# EAGLE schematic air (EAGLE 9.0.0)
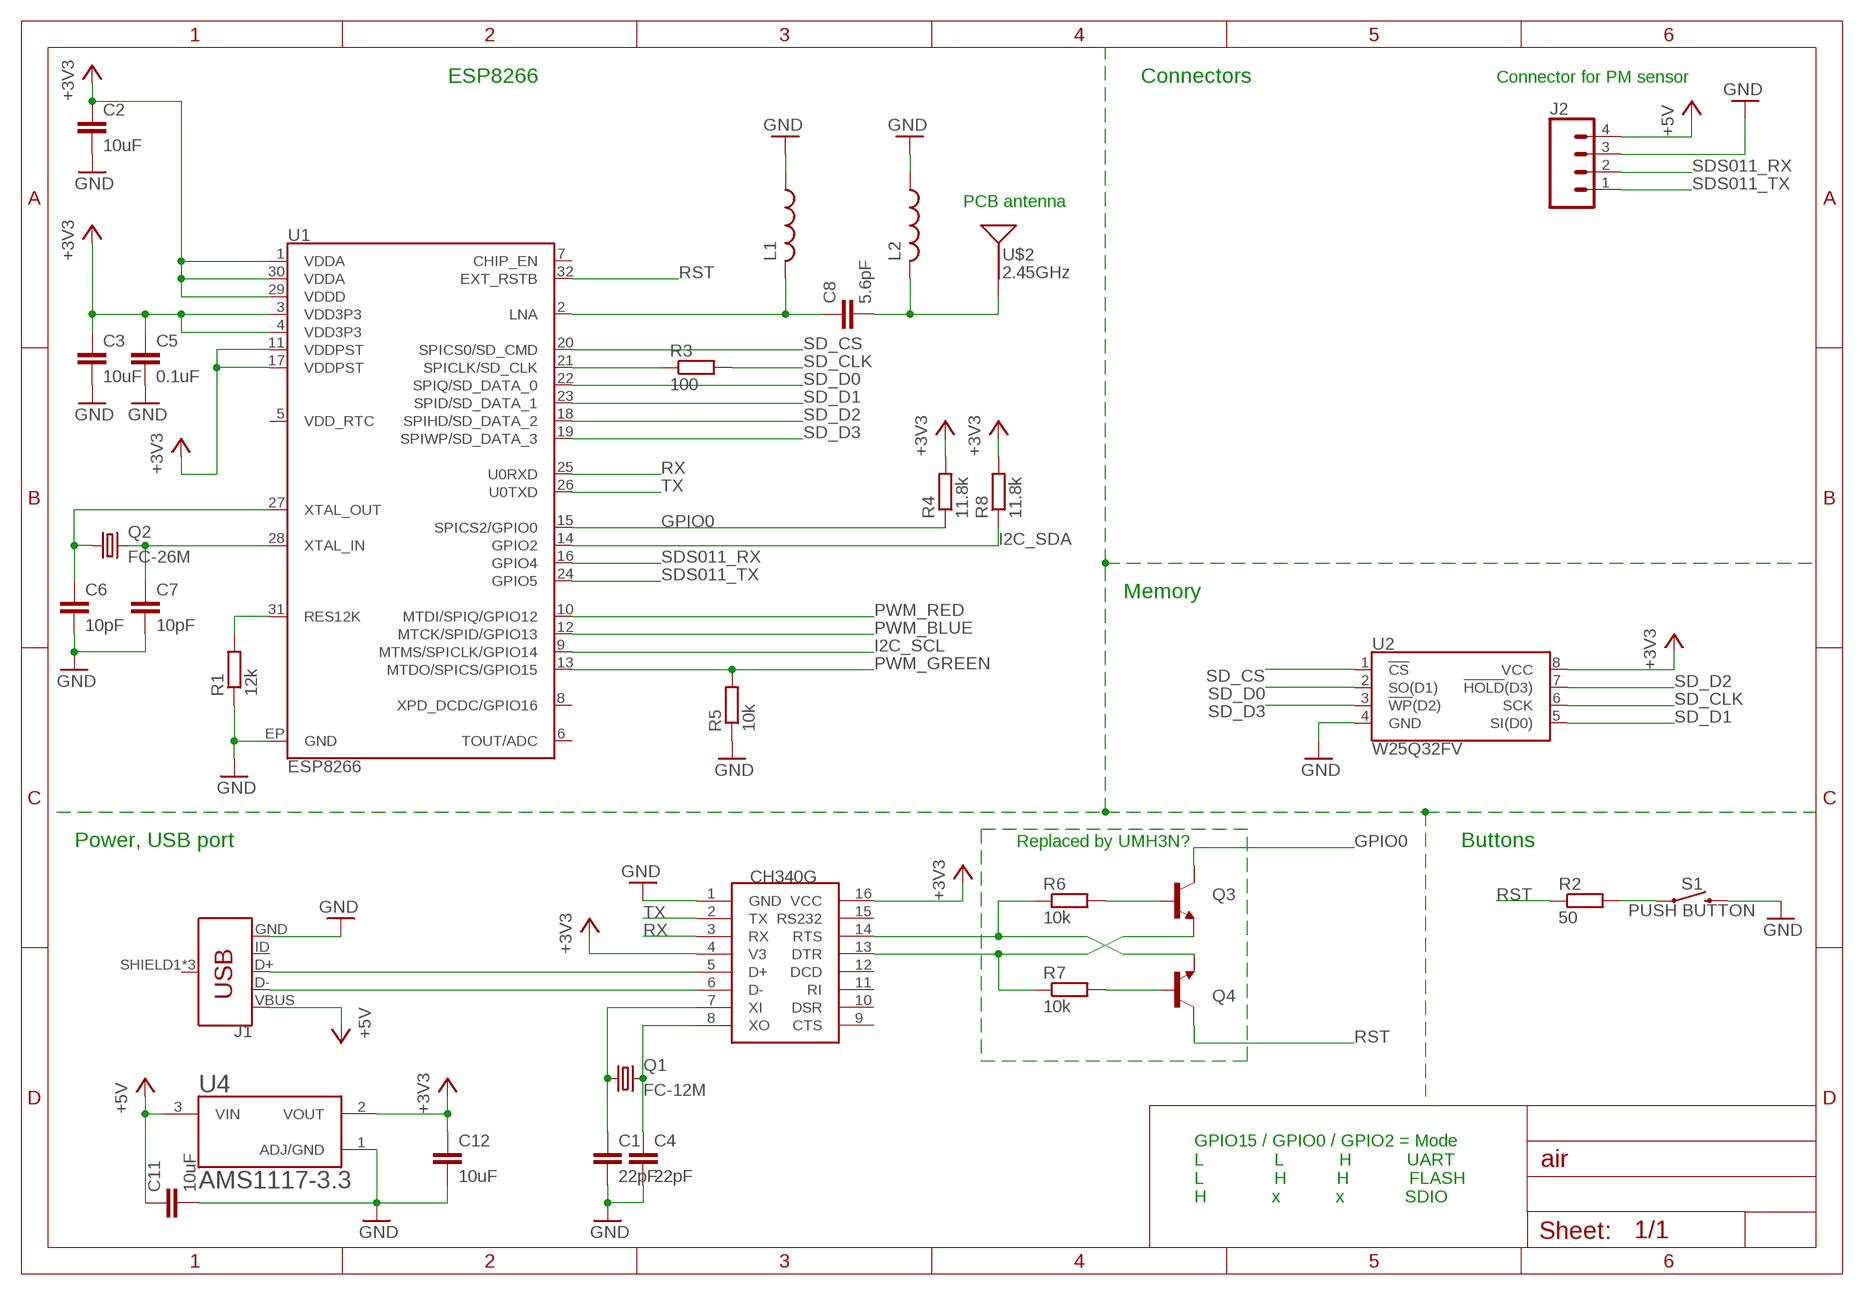
[diagram p0: schematic, sheet 1]

## Parts
C1  22pF  C-EUC1206  [C1206]
C2  10uF  C-EUC1206  [C1206]
C3  10uF  C-EUC1206  [C1206]
C4  22pF  C-EUC1206  [C1206]
C5  0.1uF  C-EUC1206  [C1206]
C6  10pF  C-EUC1206  [C1206]
C7  10pF  C-EUC1206  [C1206]
C8  5.6pF  C-EUC1206  [C1206]
C11  10uF  C-EUC1206  [C1206]
C12  10uF  C-EUC1206  [C1206]
J1  USB_MICRO-B_FEMALE-SMT  [USB-B-MICRO-SMD]
J2  CONN_04JST-PTH-VERT  [JST-4-PTH-VERT]
L1  L-USL1812  [L1812]
L2  L-USL1812  [L1812]
Q1  FC-12M  [FC-12M]
Q2  FC-26M  FC-12M  [FC-12M]
Q3  BC849SMD  [SOT23-BEC]
Q4  BC849SMD  [SOT23-BEC]
R1  12k  R-EU_R0805  [R0805]
R2  50  R-EU_R0805  [R0805]
R3  100  R-EU_R0805  [R0805]
R4  11.8k  R-EU_R0805  [R0805]
R5  10k  R-EU_R0805  [R0805]
R6  10k  R-EU_R0805  [R0805]
R7  10k  R-EU_R0805  [R0805]
R8  11.8k  R-EU_R0805  [R0805]
S1  PUSH BUTTON  MOMENTARY-SWITCH-SPST-PTH-6.0MM  [TACTILE_SWITCH_PTH_6.0MM]
U1  ESP8266  [QFN32-5X5MM]
U2  W25Q32FV  W25Q32FVSS  [SOIC-8]
U3  CH340G  [SOIC16]
U4  AMS1117-3.3  [SOT229P700X180-4N]
U$2  2.45GHz  ANTENNA2.4GHZ-6.5X2.2MM  [ANT-2.4GHZ-6.5X2.2MM]

## Nets
+3V3: C2.1 C3.1 C5.1 C12.1 R4.2 R8.2 U1.1(VDDA) U1.3(VDD3P3) U1.4(VDD3P3) U1.11(VDDPST) U1.17(VDDPST) U1.29(VDDD) U1.30(VDDA) U2.8(VCC) U3.4(V3) U3.16(VCC) U4.2(VOUT)
+5V: C11.1 J1.VBUS J2.4 U4.3(VIN)
GND: C1.2 C2.2 C3.2 C4.2 C5.2 C6.2 C7.2 C11.2 C12.2 J1.GND J2.3 L1.1 L2.1 R1.1 R5.1 S1.3 U1.EP(GND) U2.4(GND) U3.1(GND) U4.1(ADJ/GND)
GPIO0: Q3.C R4.1 U1.15(SPICS2/GPIO0)
I2C_SCL: U1.9(MTMS/SPICLK/GPIO14)
I2C_SDA: R8.1 U1.14(GPIO2)
N$1: R3.1 U1.21(SPICLK/SD_CLK)
N$2: C6.1 Q2.1 U1.27(XTAL_OUT)
N$3: J1.D+ U3.5(D+)
N$4: C7.1 Q2.2 U1.28(XTAL_IN)
N$5: R1.2 U1.31(RES12K)
N$6: J1.D- U3.6(D-)
N$7: C1.1 Q1.1 U3.7(XI)
N$8: C4.1 Q1.2 U3.8(XO)
N$9: R2.2 S1.1
N$10: C8.1 L1.2 U1.2(LNA)
N$11: C8.2 L2.2 U$2.FEED(SIGNAL)
N$14: Q4.E R6.1 U3.14(RTS)
N$15: Q3.E R7.1 U3.13(DTR)
N$16: Q3.B R6.2
N$17: Q4.B R7.2
PWM_GREEN: R5.2 U1.13(MTDO/SPICS/GPIO15)
PWM_RED: U1.10(MTDI/SPIQ/GPIO12)
RST: Q4.C R2.1 U1.32(EXT_RSTB)
RX: U1.25(U0RXD) U3.3(RX)
SD_CLK: R3.2 U2.6(SCK)
SD_CS: U1.20(SPICS0/SD_CMD) U2.1(!CS!)
SD_D0: U1.22(SPIQ/SD_DATA_0) U2.2(SO(D1))
SD_D1: U1.23(SPID/SD_DATA_1) U2.5(SI(D0))
SD_D2: U1.18(SPIHD/SD_DATA_2) U2.7(!HOLD!(D3))
SD_D3: U1.19(SPIWP/SD_DATA_3) U2.3(!WP!(D2))
SDS011_RX: J2.2 U1.16(GPIO4)
SDS011_TX: J2.1 U1.24(GPIO5)
TX: U1.26(U0TXD) U3.2(TX)
Unconnected: J1.ID J1.SHIELD1(SHIELD) J1.SHIELD2(SHIELD) J1.SHIELD3(SHIELD) U1.5(VDD_RTC) U1.6(TOUT/ADC) U1.7(CHIP_EN) U1.8(XPD_DCDC/GPIO16) U1.12(MTCK/SPID/GPIO13) U3.9(CTS) U3.10(DSR) U3.11(RI) U3.12(DCD) U3.15(RS232)

## Notes on the sheet
- ESP8266 | Connectors | Connector for PM sensor
- PCB antenna
- Memory
- Power, USB port | Replaced by UMH3N? | Buttons
- GPIO15 / GPIO0 / GPIO2 = Mode
  L              L           H           UART
  L              H          H            FLASH
  H             x           x            SDIO

## Library data of the parts
C1-C8 C11 C12 = rcl:C-EU: CAPACITOR, European symbol; SPICEPREFIX: C
J1 = SparkFun-Connectors:USB_MICRO-B: USB Type Micro-B Connector Male/female and PTH/SMT variants SparkFun Products: SparkFun microB USB Breakout <https://www.sparkfun.com/products/12035> SparkFun USB microB Plug Breakout <https://www.sparkfun.com/products/10031> SparkFun ESP8266 Thing <https://www.sparkfun.com/products/13231>; PROD_ID: CONN-11752
J2 = SparkFun-Connectors:CONN_04: Multi connection point. Often used as Generic Header-pin footprint for 0.1 inch spaced/style header connections On any of the 0.1 inch spaced packages, you can populate with these: Break Away Headers - Straight <https://www.sparkfun.com/products/116> (PRT-00116) Break Away Male Headers - Right Angle <https://www.sparkfun.com/products/553> (PRT-00553) Female Headers <https://www.sparkfun.com/products/115> (PRT-00115) Break Away Headers - Machine Pin <https://www.sparkfun.com/products/117> (PRT-00117) Break Away Female Headers - Swiss Machine Pin <https://www.sparkfun.com/products/743> (PRT-00743) For SCREWTERMINALS and SPRING TERMINALS visit here: Screw Terimnals on SparkFun.com <https://www.sparkfun.com/search/results?term=Screw+Terminals> (5mm/3.5mm/2.54mm spacing) This device is also useful as a general connection point to wire up your design to another part of your project. Our various solder wires solder well into these plated through hole pads. Hook-Up Wire - Assortment (Stranded, 22 AWG) <https://www.sparkfun.com/products/11375> (PRT-11375) Hook-Up Wire - Assortment (Solid Core, 22 AWG) <https://www.sparkfun.com/products/11367> (PRT-11367) View the entire wire category on our website here <https://www.sparkfun.com/categories/141> Special notes: Molex polarized connector foot print use with SKU : PRT-08231 with associated crimp pins and housings. 1MM SMD Version SKU: PRT-10208; PROD_ID: CONN-13251
L1 L2 = rcl:L-US: INDUCTOR, American symbol; SPICEPREFIX: L
Q1 Q2 = crystal:FC-12M: kHz RANGE CRYSTAL UNIT LOW PROFILE SMD Source: Epson Toyocom FC-12M.pdf
Q3 Q4 = transistor-npn:BC849*: NPN Transistor
R1-R8 = rcl:R-EU_: RESISTOR, European symbol; SPICEPREFIX: R
S1 = SparkFun-Switches:MOMENTARY-SWITCH-SPST: Momentary Switch (Pushbutton) - SPST Normally-open (NO) SPST momentary switches (buttons, pushbuttons). Variants PTH-12MM - 12mm square, through-hole Momentary Pushbutton Switch - 12mm Square <https://www.sparkfun.com/products/9190> (COM-09190) PTH-6.0MM, PTH-6.0MM-KIT - 6.0mm square, through-hole Mini Pushbutton Switch <https://www.sparkfun.com/products/97> (COM-00097) KIT package intended for soldering kit's - only one side of pads' copper is exposed. PTH-RIGHT-ANGLE-KIT - Right-angle, through-hole Right Angle Tactile Button <https://www.sparkfun.com/products/10791> - Used on SparkFun BigTime Watch Kit <https://www.sparkfun.com/products/11734> SMD-12MM - 12mm square, surface-mount Tactile Button - SMD (12mm) <https://www.sparkfun.com/products/12993> (COM-12993) Used on SparkFun PicoBoard <https://www.sparkfun.com/products/11888> SMD-4.5MM - 4.5mm Square Trackball Switch Used on SparkFun Blackberry Trackballer Breakout <https://www.sparkfun.com/products/13169> SMD-4.6MMX2.8MM - 4.60mm x 2.80mm, surface mount Used on SparkFun SAMD21 Mini Breakout <https://www.sparkfun.com/products/13664> SMD-5.2MM, SMD-5.2-REDUNDANT - 5.2mm square, surface-mount Mini Pushbutton Switch - SMD <https://www.sparkfun.com/products/8720> (COM-08720) Used on Arduino Pro Mini <https://www.sparkfun.com/products/11114> REDUNDANT package connects both switch circuits together SMD-6.0X3.5MM - 6.0 x 3.5mm, surface mount Momentary Reset Switch SMD <https://www.sparkfun.com/products/8229> (COM-08229) SMD-6.2MM-TALL - 6.2mm square, surface mount Tactile Button - SMD (6mm) <https://www.sparkfun.com/products/12992> Used on SparkFun Digital Sandbox <https://www.sparkfun.com/products/12651> SMD-RIGHT-ANGLE - Right-angle, surface mount Used on SparkFun Block for Intel® Edison - Arduino <https://www.sparkfun.com/products/13036>; PROD_ID: SWCH-08441; SF_SKU: COM-00097
U1 = SparkFun-RF:ESP8266: Espressif ESP8266 WiFi/Microcontroller SoC The ESP8266 WiFi Module is a self contained SOC with integrated TCP/IP protocol stack that can give any microcontroller access to your WiFi network. The ESP8266 is capable of either hosting an application or offloading all Wi-Fi networking functions from another application processor. SparkFun Products WiFi Module ESP8266 <https://www.sparkfun.com/products/13678> (WRL-13678) SparkFun ESP8266 Thing <https://www.sparkfun.com/products/13231> (WRL-13231) SparkFun WiFi Shield - ESP8266 <https://www.sparkfun.com/products/13287> (WRL-13287) SparkFun ESP8266 Thing - Dev Board <https://www.sparkfun.com/products/13711> (WRL-13711) SparkFun Blynk Board - ESP8266 <https://www.sparkfun.com/products/13794> (WRL-13794); PROD_ID: IC-12452
U2 = SparkFun-IC-Memory:W25Q32FV: W25Q32FV 32Mb (4MB) Serial Flash Memory The W25Q32FV support the standard Serial Peripheral Interface (SPI), Dual/Quad I/O SPI as well as 2-clocks instruction cycle Quad Peripheral Interface (QPI). 104MHz, SPI, 8-SOIC-EIAJ Datasheet <http://www.winbond.com/resource-files/w25q32fv%20revh%20091613.pdf> SparkFun Products SparkFun Blynk Board - ESP8266 <https://www.sparkfun.com/products/13794> (WRL-13794); PROD_ID: IC-13229
U3 = ch340g:CH340G
U4 = AMS1117-3.3:AMS1117-3.3: Sot223/Pkg 1-Amp 3.3-Volt Low Drop Out Voltage Regulatator; AVAILABILITY: Unavailable; DESCRIPTION: Sot-89; MF: ams; MP: AMS1117-3.3; PACKAGE: SOT-89 ams; PRICE: None
U$2 = SparkFun-RF:ANTENNA: Single-ended Antennae 2.4GHz and antennae with just one terminal. These are all chip antennae. 2.4GHz (WiFi/BT/ZigBee) Antennae ANT-2.4GHZ-6.5X2.2MM - 6.5 x 2.2 mm chip antenna. (SparkFun Product <https://www.sparkfun.com/products/144>) ANT-2.4GHZ8.0X1.0MM - 8.0 x 1.0 mm chip antenna. (Datasheet <http://www.mouser.com/ds/2/611/antenna_2500at44m0400-242425.pdf>) ANT-2.4GHZ9.5X2.0MM - 9.5 x 2.0 mm chip antenna. (SparkFun Product <https://www.sparkfun.com/products/9025>); PROD_ID: ANT-08187; SF_ID: WRL-00144